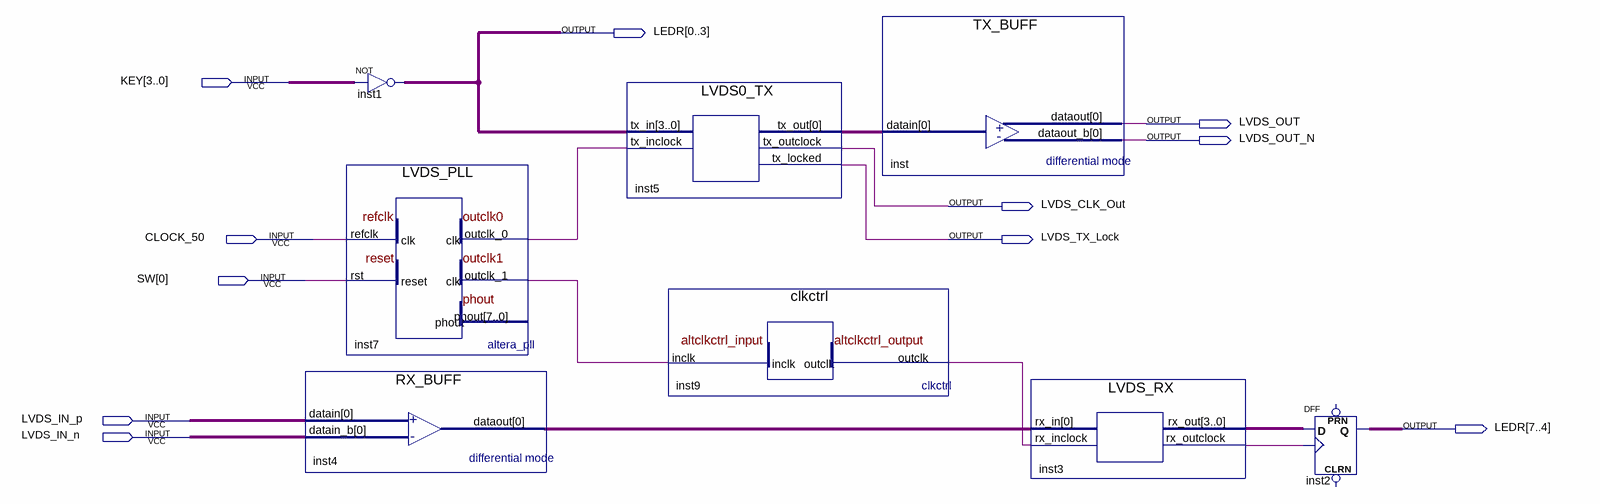
[diagram p0: schematic sheet]
// Quartus schematic LVDS_xceiver.bdf as structural Verilog: 8 symbols, 11 pins
module LVDS_xceiver (
  input  [3:0] KEY,
  input  CLOCK_50,
  input  [0:0] SW,
  input  LVDS_IN_p,
  input  LVDS_IN_n,
  output [0:7] LEDR,
  output LVDS_OUT,
  output LVDS_OUT_N,
  output LVDS_CLK_Out,
  output LVDS_TX_Lock
);

  wire inst3_rx_outclock, inst4_dataout, inst5_tx_out, inst7_outclk_0, inst7_outclk_1, inst9_outclk;
  wire [3:0] inst3_rx_out;

  RX_BUFF inst4 (.datain(LVDS_IN_p), .datain_b(LVDS_IN_n), .dataout(inst4_dataout));
  assign LEDR[0:3] = ~KEY;  // NOT inst1, 4 bits wide
  LVDS_PLL inst7 (.refclk(CLOCK_50), .rst(SW[0]), .outclk_0(inst7_outclk_0), .outclk_1(inst7_outclk_1));  // open: phout
  LVDS0_TX inst5 (
    .tx_in(LEDR[0:3]), .tx_inclock(inst7_outclk_0), .tx_out(inst5_tx_out), .tx_outclock(LVDS_CLK_Out),
    .tx_locked(LVDS_TX_Lock));
  clkctrl inst9 (.inclk(inst7_outclk_1), .outclk(inst9_outclk));
  TX_BUFF inst (.datain(inst5_tx_out), .dataout(LVDS_OUT), .dataout_b(LVDS_OUT_N));
  LVDS_RX inst3 (
    .rx_in(inst4_dataout), .rx_inclock(inst9_outclk), .rx_out(inst3_rx_out), .rx_outclock(inst3_rx_outclock));
  DFF inst2[3:0] (
    .CLK(inst3_rx_outclock), .D(inst3_rx_out), .Q({LEDR[7], LEDR[6], LEDR[5], LEDR[4]}));  // open: CLRN, PRN
endmodule
